# Altium schematic sheet MainConnector.SchDoc
size A; SheetNumber: 7; SheetTotal: 11
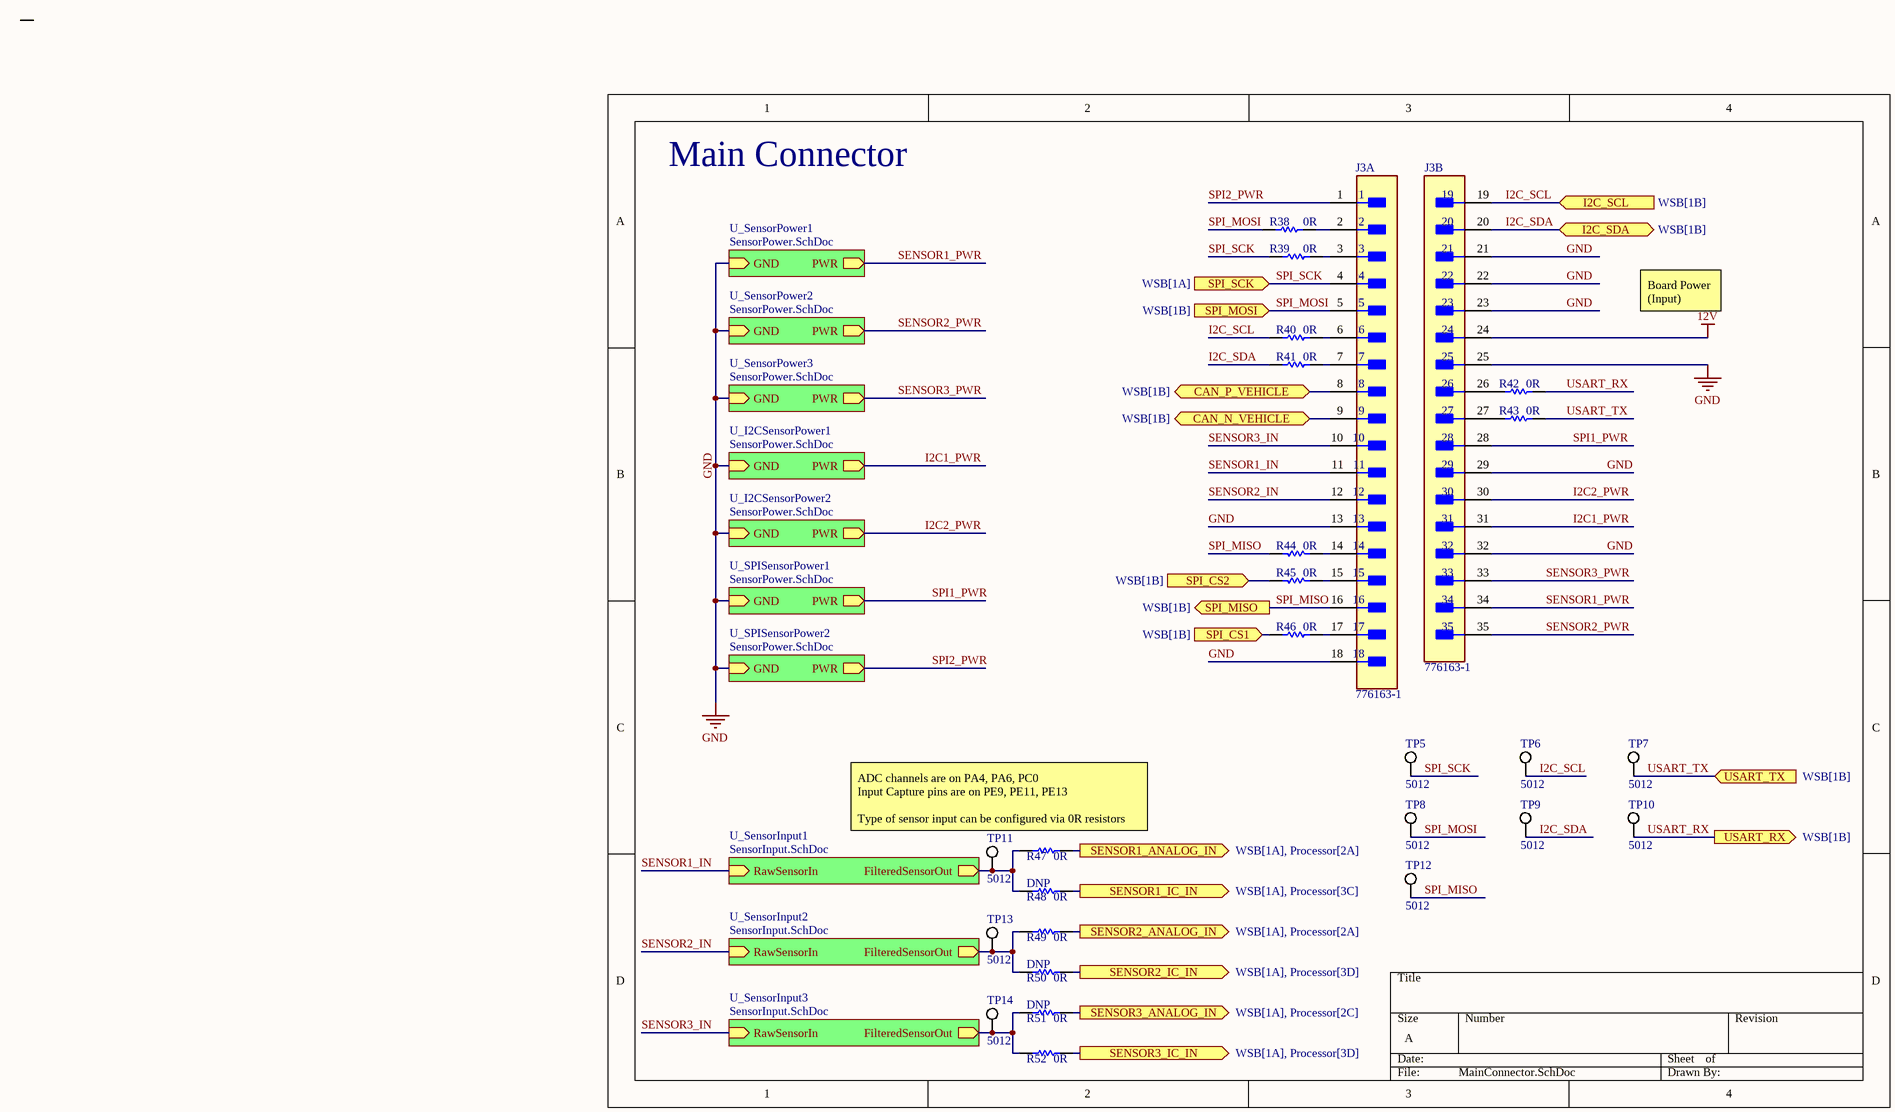
[diagram p0: MainConnector.SchDoc]

## Parts
J3  776163-1  [FP-776163-1-MFG]  (parts A,B of 2)
R38  Resistance: 0R  [RESC2013X60X35LL10T20]  (hidden comment: RC0805JR-100RL)
R39  Resistance: 0R  [RESC2013X60X35LL10T20]  (hidden comment: RC0805JR-100RL)
R40  Resistance: 0R  [RESC2013X60X35LL10T20]  (hidden comment: RC0805JR-100RL)
R41  Resistance: 0R  [RESC2013X60X35LL10T20]  (hidden comment: RC0805JR-100RL)
R42  Resistance: 0R  [RESC2013X60X35LL10T20]  (hidden comment: RC0805JR-100RL)
R43  Resistance: 0R  [RESC2013X60X35LL10T20]  (hidden comment: RC0805JR-100RL)
R44  Resistance: 0R  [RESC2013X60X35LL10T20]  (hidden comment: RC0805JR-100RL)
R45  Resistance: 0R  [RESC2013X60X35LL10T20]  (hidden comment: RC0805JR-100RL)
R46  Resistance: 0R  [RESC2013X60X35LL10T20]  (hidden comment: RC0805JR-100RL)
R47  Resistance: 0R  [RESC2013X60X35LL10T20]  (hidden comment: RC0805JR-100RL)
R48  Resistance: 0R  [RESC2013X60X35LL10T20]  (hidden comment: RC0805JR-100RL)
R49  Resistance: 0R  [RESC2013X60X35LL10T20]  (hidden comment: RC0805JR-100RL)
R50  Resistance: 0R  [RESC2013X60X35LL10T20]  (hidden comment: RC0805JR-100RL)
R51  Resistance: 0R  [RESC2013X60X35LL10T20]  (hidden comment: RC0805JR-100RL)
R52  Resistance: 0R  [RESC2013X60X35LL10T20]  (hidden comment: RC0805JR-100RL)
TP5  5012  [KSTN-5012_V]
TP6  5012  [KSTN-5012_V]
TP7  5012  [KSTN-5012_V]
TP8  5012  [KSTN-5012_V]
TP9  5012  [KSTN-5012_V]
TP10  5012  [KSTN-5012_V]
TP11  5012  [KSTN-5012_V]
TP12  5012  [KSTN-5012_V]
TP13  5012  [KSTN-5012_V]
TP14  5012  [KSTN-5012_V]

## Sub-sheets
U_I2CSensorPower1 = SensorPower.SchDoc: PWR (out), GND (in)
U_I2CSensorPower2 = SensorPower.SchDoc: PWR (out), GND (in)
U_SensorInput1 = SensorInput.SchDoc: RawSensorIn (in), FilteredSensorOut (out)
U_SensorInput2 = SensorInput.SchDoc: RawSensorIn (in), FilteredSensorOut (out)
U_SensorInput3 = SensorInput.SchDoc: RawSensorIn (in), FilteredSensorOut (out)
U_SensorPower1 = SensorPower.SchDoc: PWR (out), GND (in)
U_SensorPower2 = SensorPower.SchDoc: PWR (out), GND (in)
U_SensorPower3 = SensorPower.SchDoc: PWR (out), GND (in)
U_SPISensorPower1 = SensorPower.SchDoc: PWR (out), GND (in)
U_SPISensorPower2 = SensorPower.SchDoc: PWR (out), GND (in)

## Ports
CAN_N_VEHICLE (bidir, see WSB[1B]), CAN_P_VEHICLE (bidir, see WSB[1B]), I2C_SCL (in, see WSB[1B]), I2C_SDA (bidir, see WSB[1B]), SENSOR1_ANALOG_IN (out, see WSB[1A], Processor[2A]), SENSOR1_IC_IN (out, see WSB[1A], Processor[3C]), SENSOR2_ANALOG_IN (out, see WSB[1A], Processor[2A]), SENSOR2_IC_IN (out, see WSB[1A], Processor[3D]), SENSOR3_ANALOG_IN (out, see WSB[1A], Processor[2C]), SENSOR3_IC_IN (out, see WSB[1A], Processor[3D]), SPI_CS1 (in, see WSB[1B]), SPI_CS2 (in, see WSB[1B]), SPI_MISO (out, see WSB[1B]), SPI_MOSI (in, see WSB[1B]), SPI_SCK (in, see WSB[1A]), USART_RX (out, see WSB[1B]), USART_TX (in, see WSB[1B])

## Nets
12V: J3.24
GND: J3.13 J3.18 J3.21 J3.22 J3.23 J3.25 J3.29 J3.32 ; sheet U_SensorPower2/GND, sheet U_SensorPower1/GND, sheet U_SensorPower3/GND, sheet U_I2CSensorPower1/GND, sheet U_I2CSensorPower2/GND, sheet U_SPISensorPower1/GND, sheet U_SPISensorPower2/GND
CAN_N_VEHICLE: J3.9 ; port CAN_N_VEHICLE
CAN_P_VEHICLE: J3.8 ; port CAN_P_VEHICLE
I2C1_PWR: J3.31 ; sheet U_I2CSensorPower1/PWR
I2C2_PWR: J3.30 ; sheet U_I2CSensorPower2/PWR
I2C_SCL: J3.19 R40.2 TP6.1 ; port I2C_SCL
I2C_SDA: J3.20 R41.2 TP9.1 ; port I2C_SDA
SENSOR1_ANALOG_IN: R47.1 ; port SENSOR1_ANALOG_IN
SENSOR1_IC_IN: R48.1 ; port SENSOR1_IC_IN
SENSOR1_IN: J3.11 ; sheet U_SensorInput1/RawSensorIn
SENSOR1_PWR: J3.34 ; sheet U_SensorPower1/PWR
SENSOR2_ANALOG_IN: R49.1 ; port SENSOR2_ANALOG_IN
SENSOR2_IC_IN: R50.1 ; port SENSOR2_IC_IN
SENSOR2_IN: J3.12 ; sheet U_SensorInput2/RawSensorIn
SENSOR2_PWR: J3.35 ; sheet U_SensorPower2/PWR
SENSOR3_ANALOG_IN: R51.1 ; port SENSOR3_ANALOG_IN
SENSOR3_IC_IN: R52.1 ; port SENSOR3_IC_IN
SENSOR3_IN: J3.10 ; sheet U_SensorInput3/RawSensorIn
SENSOR3_PWR: J3.33 ; sheet U_SensorPower3/PWR
SPI1_PWR: J3.28 ; sheet U_SPISensorPower1/PWR
SPI2_PWR: J3.1 ; sheet U_SPISensorPower2/PWR
SPI_CS1: R46.2 ; port SPI_CS1
SPI_CS2: R45.1 ; port SPI_CS2
SPI_MISO: J3.16 R44.1 TP12.1 ; port SPI_MISO
SPI_MOSI: J3.5 R38.2 TP8.1 ; port SPI_MOSI
SPI_SCK: J3.4 R39.1 TP5.1 ; port SPI_SCK
USART_RX: R42.1 TP10.1 ; port USART_RX
USART_TX: R43.1 TP7.1 ; port USART_TX
NetJ3_2: J3.2 R38.1
NetJ3_3: J3.3 R39.2
NetJ3_6: J3.6 R40.1
NetJ3_7: J3.7 R41.1
NetJ3_14: J3.14 R44.2
NetJ3_15: J3.15 R45.2
NetJ3_17: J3.17 R46.1
NetJ3_26: J3.26 R42.2
NetJ3_27: J3.27 R43.2
NetR47_2: R47.2 R48.2 TP11.1 ; sheet U_SensorInput1/FilteredSensorOut
NetR49_2: R49.2 R50.2 TP13.1 ; sheet U_SensorInput2/FilteredSensorOut
NetR51_2: R51.2 R52.2 TP14.1 ; sheet U_SensorInput3/FilteredSensorOut

## Notes on the sheet
- Main Connector
- Board Power (Input)
- ADC channels are on PA4, PA6, PC0
  Input Capture pins are on PE9, PE11, PE13
  Type of sensor input can be configured via 0R resistors

## Library data of the parts
J3 = CMP-03369-000154-1: CONN HEADER R/A 35POS 4MM; Primary Type: Rectangular; Circuit Application: Power; Tab Thickness: 1.3mm; Number of Signal Positions: 35; Shielding: Unshielded; Pitch: 0.157inch; Max Voltage Rating (AC): 250V; Connector System: Wire-to-Device; Insulation: Insulated; Current Rating: 17A; PCB Thickness: 0.062inch; PCB Mount Retention: With; Gender: Male; Connector Type: Male Pin; PCB Mount Alignment: Yes (With); Series: Ampseal; Depth: 37.9mm; Orientation: Right Angle; Length: 3.03inch; Termination: Solder; Radiation Hardening: No; Number of Rows: 3; Contact Plating: Tin; Lead Free: Lead Free; Flammability Rating: UL94 V-0; Contact Material: Brass; Number of Contacts: 35; ELV: Compliant; Max Operating Temperature: 221°C; Min Operating Temperature: -40°C; Package Quantity: 1; Mount: Through Hole; Contact Type: Male Pin; Housing Material: Thermoplastic; Number of Positions: 35; Packaging: Bulk; Row Spacing: 0.157inch; RoHS Compliant: Yes; Height: 32.1mm; Color: Black; Fastening Type: Ramp; Sealable: Yes (With); Width: 37.9mm
R38-R52 = CMP-2000-06963-1: Chip Resistor, 0 Ohm, +/- 5%, 125 mW, -55 to 155 degC, 0805 (2012 Metric), RoHS, Tape and Reel; Manufacturer: Yageo; Product Length (mm): 2mm; Tolerance (+ or -): NotRequired; Case Style: Molded; Product Height (mm): 0.5mm; Power Rating(s): NotRequiredW; Product Depth (mm): 1.25mm; Mounting Technology: SurfaceMount; Military Standard: NotRequired; Operating Temp Range: -55Cto155C; Temperature Coefficient: NotRequired; Package Description: 2-Pin Surface Mounted Device, Body 2 x 1.25 mm; Datasheet Version: Rev. 7, 05/2017; Failure Rate: NotRequired; Manufacturer URL: http://www.yageo.com/; Datasheet URL: http://www.yageo.com/documents/recent/PYu-RC_Group_51_RoHS_L_7.pdf; Packaging: TapeandReel; Package Reference: 0805; Package / Case: 0805; Termination Style: NotRequired; Type: ThickFilm; Construction: Rectangular
  R48 R50 R51: DNP: DNP
TP5-TP14 = CMP-1672-00004-4: Test Point, White, Through Hole, RoHS, Bulk; Manufacturer: Keystone; DatasheetVersion: Rev. F, 12/2013; ComponentLink1URL: http://www.keyelco.com/; PackageReference: 5012; RoHSCompliant: true; ComponentLink2Description: Datasheet; Colour: White; Contact Material: Bronze; PackageDescription: 1-Pin Through Hole Device, Dia 3.17 mm; Mounting Technology: Through Hole; Mount: Through Hole; Package Quantity: 100; ComponentLink1Description: Manufacturer URL; Pins: 1; Height: 8.12 mm; Packaging: Bulk; REACH SVHC: No SVHC; Contact Plating: Silver; Length: 11.3 mm; ComponentLink2URL: http://www.keyelco.com/product-pdf.cfm?p=1321